# EAGLE design basic-inline-turbidimeter_sensor_board_4led (EAGLE 7.7.0)
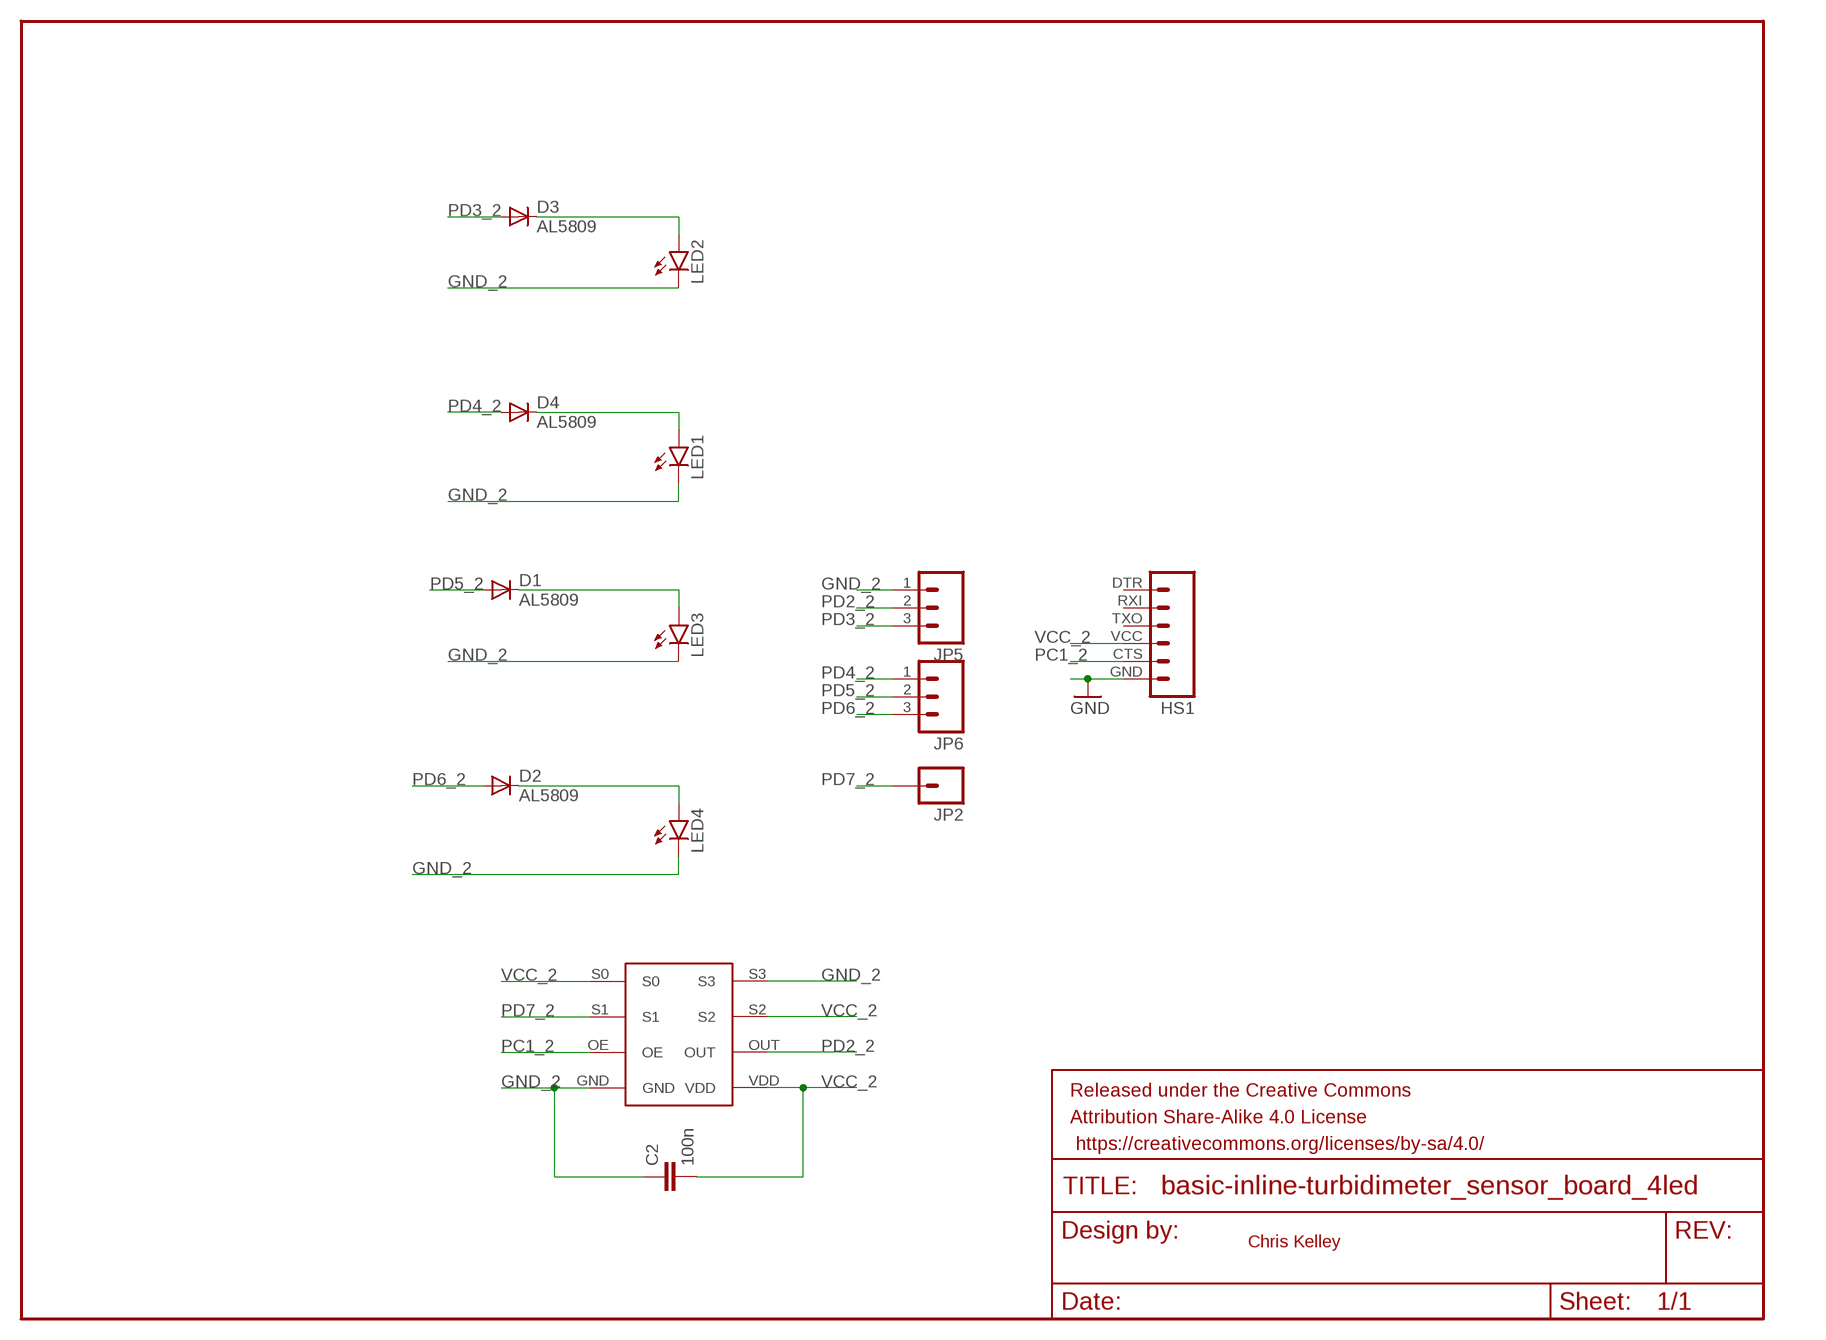
[diagram p0: schematic, sheet 1]

## Parts
C2  100n  CAP0805  [0805]
D1  AL5809  DIODE-SOD123  [SOD123]
D2  AL5809  DIODE-SOD123  [SOD123]
D3  AL5809  DIODE-SOD123  [SOD123]
D4  AL5809  DIODE-SOD123  [SOD123]
FRAME1  FRAME-LETTER  [CREATIVE_COMMONS]
HS1  M06SIP  [1X06]
JP2  M01PTH  [1X01]
JP5  M03PTH  [1X03]
JP6  M03PTH  [1X03]
LED1  LED5MM  [LED5MM]
LED2  LED5MM  [LED5MM]
LED3  LED5MM  [LED5MM]
LED4  LED5MM  [LED5MM]
S1  TSL230RDSMD  [TSL230RD]

## Nets
GND_2: C2.1 HS1.GND JP5.1 LED1.K(C) LED2.K(C) LED3.K(C) LED4.K(C) S1.GND S1.S3 ; supply symbol labelled GND
LED1: D1.C LED3.A
LED2: D2.C LED4.A
N$5: D4.C LED1.A
N$7: D3.C LED2.A
PC1_2: HS1.CTS S1.OE
PD2_2: JP5.2 S1.OUT
PD3_2: D3.A JP5.3
PD4_2: D4.A JP6.1
PD5_2: D1.A JP6.2
PD6_2: D2.A JP6.3
PD7_2: JP2.1 S1.S1
VCC_2: C2.2 HS1.VCC S1.S0 S1.S2 S1.VDD
Unconnected: HS1.DTR HS1.RXI HS1.TXO

## Notes on the sheet
- Chris Kelley

## Library data of the parts
C2 = SparkFun-Capacitors:CAP: Capacitor Standard 0603 ceramic capacitor, and 0.1" leaded capacitor.
D1-D4 = diode:DIODE-: DIODE
FRAME1 = SparkFun-Aesthetics:FRAME-LETTER: Schematic Frame Standard 8.5x11 US Letter frame
HS1 = SparkFun-Connectors:M06: Header 6 Standard 6-pin 0.1" header. Use with straight break away headers (SKU : PRT-00116), right angle break away headers (PRT-00553), swiss pins (PRT-00743), machine pins (PRT-00117), and female headers (PRT-00115). Molex polarized connector foot print use with SKU : PRT-08094 with associated crimp pins and housings. NOTES ON THE VARIANTS LOCK and LOCK_LONGPADS... This footprint was designed to help hold the alignment of a through-hole component (i.e. 6-pin header) while soldering it into place. You may notice that each hole has been shifted either up or down by 0.005 of an inch from it's more standard position (which is a perfectly straight line). This slight alteration caused the pins (the squares in the middle) to touch the edges of the holes. Because they are alternating, it causes a "brace" to hold the component in place. 0.005 has proven to be the perfect amount of "off-center" position when using our standard breakaway headers. Although looks a little odd when you look at the bare footprint, once you have a header in there, the alteration is very hard to notice. Also,if you push a header all the way into place, it is covered up entirely on the bottom side. This idea of altering the position of holes to aid alignment will be further integrated into the Sparkfun Library for other footprints. It can help hold any component with 3 or more connection pins.
JP2 = SparkFun-Connectors:M01: Header 1 Standard 1-pin 0.1" header. Use with straight break away headers (SKU : PRT-00116), right angle break away headers (PRT-00553), swiss pins (PRT-00743), machine pins (PRT-00117), and female headers (PRT-00115).
JP5 JP6 = SparkFun-Connectors:M03: Header 3 Standard 3-pin 0.1" header. Use with straight break away headers (SKU : PRT-00116), right angle break away headers (PRT-00553), swiss pins (PRT-00743), machine pins (PRT-00117), and female headers (PRT-00115). Molex polarized connector foot print use with SKU : PRT-08232 with associated crimp pins and housings.
LED1-LED4 = SparkFun-LED:LED: LEDs Standard schematic elements and footprints for 5mm, 3mm, 1206, and 0603 sized LEDs. 5mm - Spark Fun Electronics SKU : COM-00529 (and others)
S1 = open_source_turbidimeter:TSL230RD

## Board
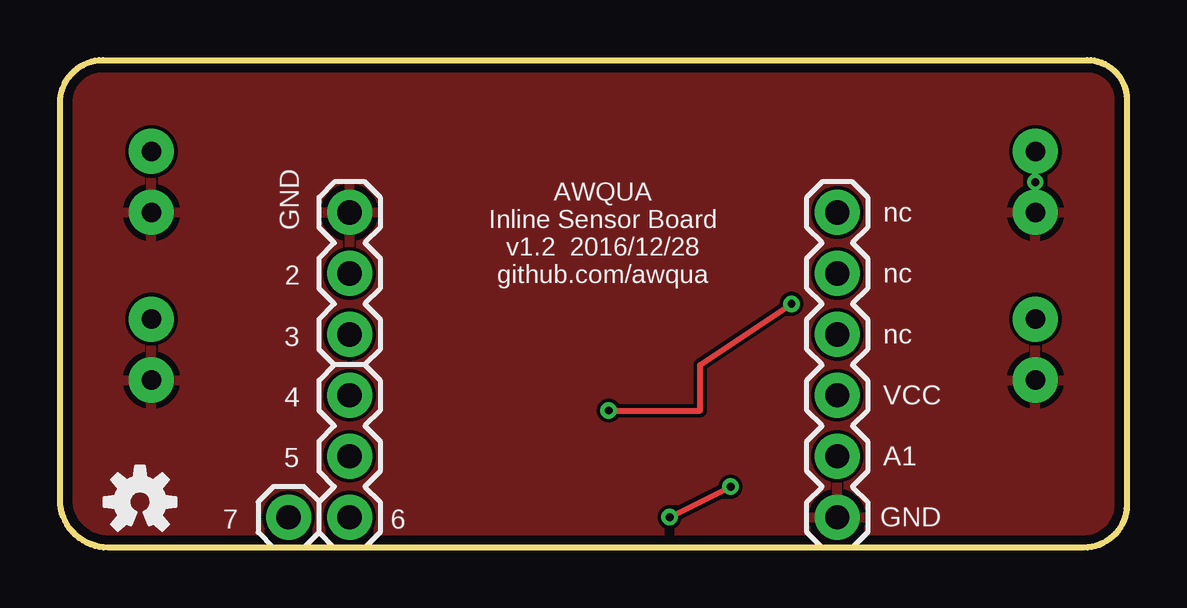
[diagram p1: board, top side]
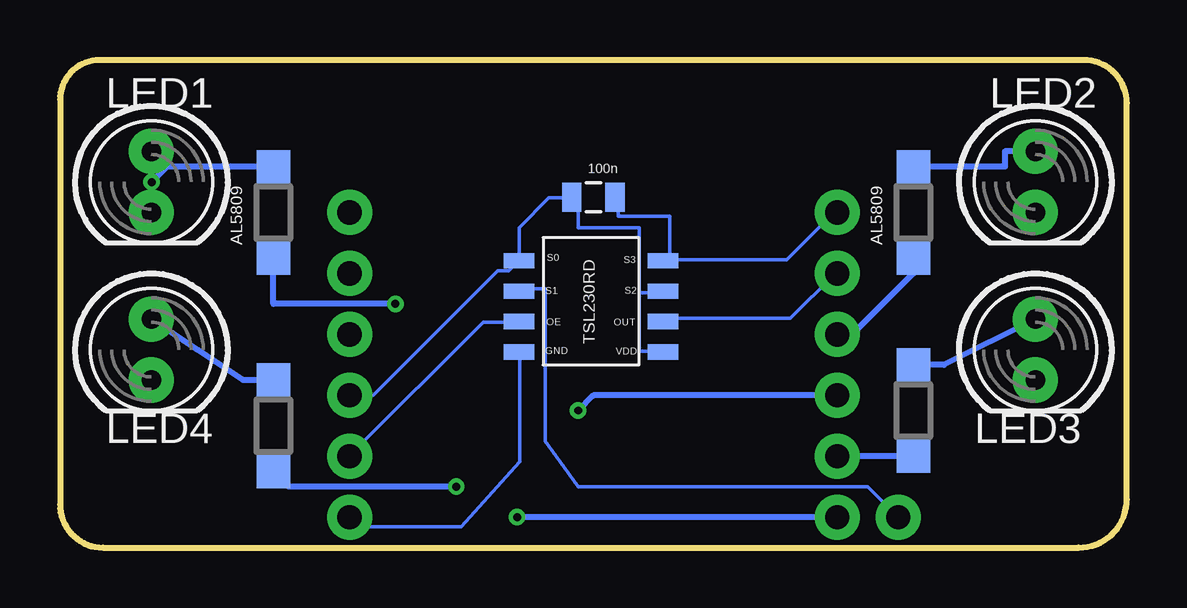
[diagram p2: board, bottom side, seen from below]

Size 44.45 x 20.32 mm. Coordinates in mm from the lower left corner, seen from the top.
Outline: 44.45,18.66 44.45,1.8 arc-90 42.65,0 2.01,0 arc-90 0,2.01 0,18.52 arc-90 1.8,20.32 42.8,20.32 arc-90 44.45,18.66
Copper layers (1*16): Top 0.0356mm / dielectric 1.5011mm / Bottom 0.0356mm
Design rules "default *": minimum track width 6mil, minimum drill 13mil, track to track 6mil, track to pad 6mil, pad to pad 6mil, via to via 6mil, smd to smd 6mil, copper to edge 15mil, drill to drill 6mil, minimum pad ring 7mil, minimum via ring 7mil, stop-mask expansion 4mil, vias tented up to drill 15mil, thermal gap 10mil

### Footprints (pad centres in the part's own frame; a part is rotated, then mirrored left to right if it is on the bottom)
0805 = smd 0.8 x 1.2: 1 -0.9,0; 2 0.9,0
SOD123 = smd 1.4 x 1.4: A 1.9,0; C -1.9,0
1X06 = drill 1.016 pad 1.88: CTS 10.16,0; DTR 0,0; GND 12.7,0; RXI 2.54,0; TXO 5.08,0; VCC 7.62,0
1X01 = drill 1.016 pad 1.88: 1 0,0
1X03 = drill 1.016 pad 1.88: 1 0,0; 2 2.54,0; 3 5.08,0
LED5MM = drill 0.813 pad 1.88: A -1.27,0; K 1.27,0
TSL230RD = smd 0.635 x 1.27: GND 0.53,5; OE 1.8,5; OUT 1.8,-1; S0 4.34,5; S1 3.07,5; S2 3.07,-1; S3 4.34,-1; VDD 0.53,-1

### Placement (x,y rotation side)
C2  22.23,14.61 180 bottom
D1  8.89,5.71 270 bottom
D2  35.56,5.08 270 bottom
D3  8.89,13.97 270 bottom
D4  35.56,13.97 270 bottom
FRAME1  15.88,-14.61 0 top  (outside the outline)
HS1  32.38,13.97 270 top
JP2  9.53,1.27 0 top
JP5  12.06,13.97 270 top
JP6  12.06,6.35 270 top
LED1  40.64,15.24 270 bottom
LED2  3.81,15.24 270 bottom
LED3  3.81,8.26 270 bottom
LED4  40.64,8.26 270 bottom
S1  20.32,7.62 90 bottom
U$5  [OSHW-LOGO-S]  3.33,1.91 0 top

### Tracks (layer width: path | path; a pad name or v marks a point on that pad's centre or on a via)
GND_2
  Bottom 0.152: C2.1 21.18,14.58 21.18,13.82 19.05,13.82 19.05,12.06 19.36,11.99 S1.S3 19.2,11.99 14.17,11.99 12.19,13.97 JP5.1 | S1.GND 25.3,8.03 25.3,3.58 27.74,0.86 32,0.86 32.31,1.17 HS1.GND
  pour Top: -3.81,27.3 47.62,27.94 47.62,-1.27 -3.81,-1.91
LED1
  Bottom 0.254: LED3.A 7.62,7.62 D1.C
LED2
  Bottom 0.254: D2.C 36.83,6.98 38.73,8.26 LED4.A
N$5  (via drill 0.33)
  Top 0.254: v40.63,15.23 LED1.A
  Bottom 0.254: D4.C 40.01,15.88 40.63,15.24 v40.63,15.23
N$7
  Bottom 0.254: LED2.A 5.08,16.51 5.08,15.88 D3.C
PC1_2
  Bottom 0.152: S1.OE 25.45,9.4 26.82,9.4 32.31,3.91 HS1.CTS
PD2_2
  Bottom 0.152: S1.OUT 19.2,9.55 14.02,9.55 12.19,11.38 JP5.2
PD3_2
  Bottom 0.254: D3.A 8.89,11.43 11.43,8.89 JP5.3
PD4_2  (via drill 0.33)
  Top 0.254: v22.86,5.71 26.67,5.71 26.67,7.62 v30.48,10.16
  Bottom 0.254: JP6.1 22.23,6.35 v22.86,5.71 | v30.48,10.16 35.56,10.16 D4.A
PD5_2
  Bottom 0.254: D1.A JP6.2
PD6_2  (via drill 0.33)
  Top 0.254: v25.4,1.27 v27.94,2.54
  Bottom 0.254: JP6.3 v25.4,1.27 | v27.94,2.54 34.92,2.54 D2.A
PD7_2
  Bottom 0.152: JP2.1 10.79,2.54 22.86,2.54 24.23,4.45 24.23,10.79 25.21,10.79 S1.S1
VCC_2
  Bottom 0.152: 20.32,10.62 20.32,13.34 22.86,13.34 22.86,13.97 23.01,14.28 23.01,14.58 C2.2 23.16,14.58 24.08,14.58 25.32,13.34 S1.S0 | S1.S2 19.36,10.62 20.32,10.62 | S1.VDD 19.36,8.18 20.27,8.18 20.32,8.23 20.32,10.62 | HS1.VCC 31.39,6.35 26.21,11.53 25.75,11.53 S1.S0 | S1.S0 25.4,11.96

### Text on the board
tPlace: nc | AWQUA / Inline Sensor Board / v1.2 2016/12/28 / github.com/awqua | 2 | nc | 3 | nc | 4 | VCC | 5 | A1 | 7 | 6 | GND
tNames: GND